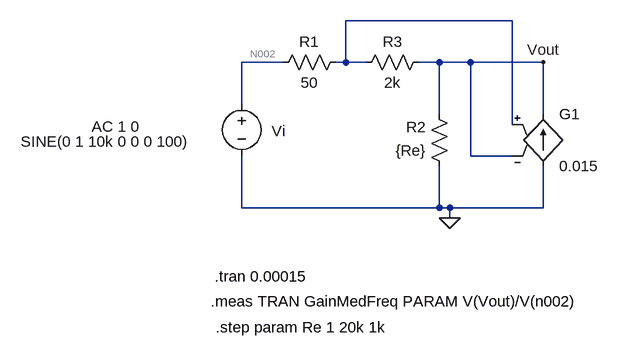
[diagram p0: schematic Draft5.asc]
Draft5.asc, the LTspice schematic file:
Version 4
SHEET 1 1108 680
WIRE 352 96 96 96
WIRE 0 160 -64 160
WIRE 96 160 96 96
WIRE 96 160 80 160
WIRE 128 160 96 160
WIRE 240 160 208 160
WIRE 288 160 240 160
WIRE 400 160 288 160
WIRE -64 224 -64 160
WIRE 240 240 240 160
WIRE 400 240 400 160
WIRE 352 256 352 96
WIRE 288 304 288 160
WIRE 352 304 288 304
WIRE -64 384 -64 304
WIRE 240 384 240 320
WIRE 240 384 -64 384
WIRE 256 384 240 384
WIRE 400 384 400 320
WIRE 400 384 256 384
WIRE 256 400 256 384
FLAG 400 160 Vout
FLAG 256 400 0
SYMBOL res 96 144 R90
WINDOW 0 0 56 VBottom 2
WINDOW 3 32 56 VTop 2
SYMATTR InstName R1
SYMATTR Value 50
SYMBOL res 256 336 R180
WINDOW 0 36 76 Left 2
WINDOW 3 36 40 Left 2
SYMATTR InstName R2
SYMATTR Value {Re}
SYMBOL g 400 224 R0
SYMATTR InstName G1
SYMATTR Value 0.015
SYMBOL res 112 176 R270
WINDOW 0 32 56 VTop 2
WINDOW 3 0 56 VBottom 2
SYMATTR InstName R3
SYMATTR Value 2k
SYMBOL voltage -64 208 R0
WINDOW 0 46 58 Left 2
WINDOW 3 -340 74 Left 2
WINDOW 123 -231 51 Left 2
WINDOW 39 0 0 Left 0
SYMATTR InstName Vi
SYMATTR Value SINE(0 1 10k 0 0 0 100)
SYMATTR Value2 AC 1 0
TEXT -106 490 Left 2 !.tran 0.00015
TEXT -112 528 Left 2 !.meas TRAN GainMedFreq PARAM V(Vout)/V(n002)
TEXT -104 568 Left 2 !.step param Re 1 20k 1k

The netlist it stands for:
* Draft5.asc
R1 N001 N002 50
R2 0 Vout {Re}
G1 0 Vout N001 Vout 0.015
R3 N001 Vout 2k
Vi N002 0 SINE(0 1 10k 0 0 0 100) AC 1 0
.tran 0.00015
.meas TRAN GainMedFreq PARAM V(Vout)/V(n002)
.step param Re 1 20k 1k
.backanno
.end